# Altium schematic sheet MCU.SchDoc
size A3; SheetNumber: 1; SheetTotal: 2
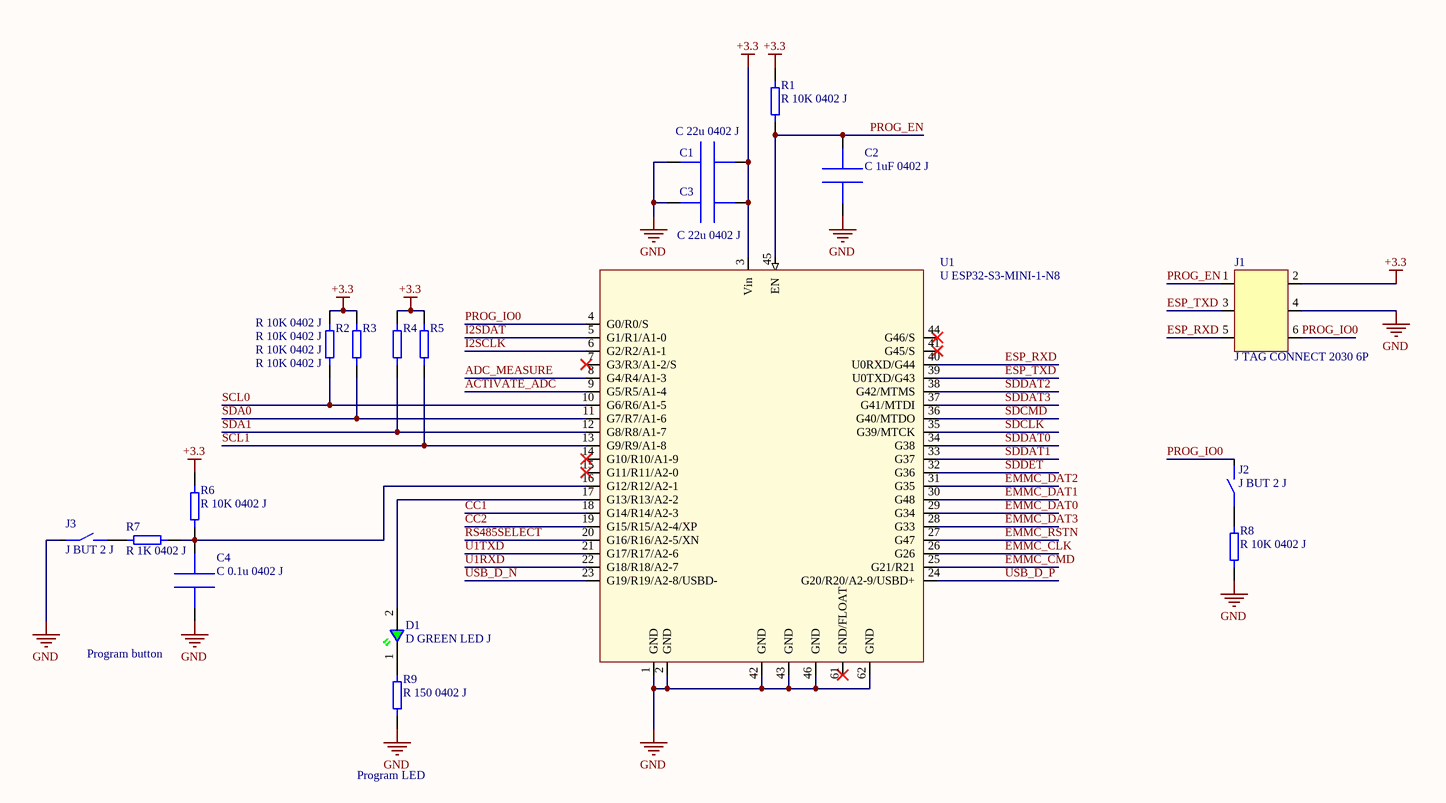
[diagram p0: MCU.SchDoc]

## Parts
C1  C 22u 0402 J  [C0402]
C2  C 1uF 0402 J  [C0402]
C3  C 22u 0402 J  [C0402]
C4  C 0.1u 0402 J  [C0402]
D1  D GREEN LED J  [NCD0402C1]
J1  J TAG CONNECT 2030 6P  [TAG-CONNECT-6]  (no BOM)
J2  J BUT 2 J  [ALPSALPINE BUTTON]
J3  J BUT 2 J  [ALPSALPINE BUTTON]
R1  R 10K 0402 J  [R0402]
R2  R 10K 0402 J  [R0402]
R3  R 10K 0402 J  [R0402]
R4  R 10K 0402 J  [R0402]
R5  R 10K 0402 J  [R0402]
R6  R 10K 0402 J  [R0402]
R7  R 1K 0402 J  [R0402]
R8  R 10K 0402 J  [R0402]
R9  R 150 0402 J  [R0402]
U1  U ESP32-S3-MINI-1-N8  [ESP-S3-MINI]

## Nets
+3.3: C1.1 C3.1 J1.2 R1.2 R2.2 R3.2 R4.2 R5.2 R6.2 U1.3(Vin)
GND: C1.2 C2.1 C3.2 C4.1 J1.4 J3.1 R8.1 R9.1 U1.1(GND) U1.2(GND) U1.42(GND) U1.43(GND) U1.46(GND) U1.62(GND)
ACTIVATE_ADC: U1.9(G5/R5/A1-4)
ADC_MEASURE: U1.8(G4/R4/A1-3)
CC1: U1.18(G14/R14/A2-3)
CC2: U1.19(G15/R15/A2-4/XP)
EMMC_CLK: U1.26(G26)
EMMC_CMD: U1.25(G21/R21)
EMMC_DAT0: U1.29(G34)
EMMC_DAT1: U1.30(G48)
EMMC_DAT2: U1.31(G35)
EMMC_DAT3: U1.28(G33)
EMMC_RSTN: U1.27(G47)
ESP_RXD: J1.5 U1.40(U0RXD/G44)
ESP_TXD: J1.3 U1.39(U0TXD/G43)
I2SCLK: U1.6(G2/R2/A1-1)
I2SDAT: U1.5(G1/R1/A1-0)
PROG_EN: C2.2 J1.1 R1.1 U1.45(EN)
PROG_IO0: J1.6 J2.2 U1.4(G0/R0/S)
RS485SELECT: U1.20(G16/R16/A2-5/XN)
SCL0: R2.1 U1.10(G6/R6/A1-5)
SCL1: R5.1 U1.13(G9/R9/A1-8)
SDA~{0}: R3.1 U1.11(G7/R7/A1-6)
SDA1: R4.1 U1.12(G8/R8/A1-7)
SDCLK: U1.35(G39/MTCK)
SDCMD: U1.36(G40/MTDO)
SDDAT0: U1.34(G38)
SDDAT1: U1.33(G37)
SDDAT2: U1.38(G42/MTMS)
SDDAT3: U1.37(G41/MTDI)
SDDET: U1.32(G36)
U1RXD: U1.22(G18/R18/A2-7)
U1TXD: U1.21(G17/R17/A2-6)
USB_D_N: U1.23(G19/R19/A2-8/USBD-)
USB_D_P: U1.24(G20/R20/A2-9/USBD+)
NetC4_2: C4.2 R6.1 R7.2 U1.16(G12/R12/A2-1)
NetD1_1: D1.1 R9.2
NetD1_2: D1.2 U1.17(G13/R13/A2-2)
NetJ2_1: J2.1 R8.2
NetJ3_2: J3.2 R7.1

Not connected (* = marked no-connect by the designer): U1 7(G3/R3/A1-2/S)* 14(G10/R10/A1-9)* 15(G11/R11/A2-0)* 41(G45/S)* 44(G46/S)* 61(GND/FLOAT)*

## Notes on the sheet
- (near C4) Program button
- Program LED

## Library data of the parts
C1 C3 = C 22u 0402 J: Multi-Layer Ceramic Capacitor 22uF 2.5VDC X6S 20% 0402 Paper T/R GRM155C80E226ME11D; Manufacturer: Murata; Supplier 1: Mouser; Manufacturer Part Number: GRM155C80E226ME11D; RoHS: Yes; Category: Ceramic Capacitors; Stock 1: 30000; Pricing 1: 1=0,32000, 10=0,22300, 50=0,22300, 100=0,13400, 1000=0,08500, 10000=0,06900 (USD); Supplier Part Number 1: 81-GRM155C80E226ME1D; JLCPCB: C907955
C2 = C 1uF 0402 J: Ceramic capacitor SMD 0402 - 1000nF, 10V, +-10%, X5R CL05A105KP5NNNC; Manufacturer: Samsung; Tolerance: 10%; Supplier 1: Arrow Electronics; Manufacturer Part Number: CL05A105KP5NNNC; RoHS: Yes; Category: Ceramic Capacitors; Stock 1: 131; Pricing 1: 1=0,06300, 10=0,04210, 25=0,03040, 100=0,01620, 500=0,01020 (USD); Mount: Surface Mount; Case/Package: 0402; Case Code (Metric): 1005; Case Code (Imperial): 0402; Contact Plating: Tin; Material: Ceramic; Min Operating Temperature: -55°C; Max Operating Temperature: 85°C; Capacitance: 1uF; Package Quantity: 1; Packaging: Tape and Reel; Voltage Rating: 10V; Dielectric: X5R; Series: CL; Length: 1mm; Width: 0.02inch; Height: 0.5mm; Thickness: 0.022inch; Depth: 0.5mm; Radiation Hardening: No; RoHS Compliant: Yes; ComponentLink1URL: http://www.farnell.com/datasheets/2710650.pdf?src-supplier=Farnell; ComponentLink1Description: http://www.farnell.com/datasheets/2710650.pdf?src-supplier=Farnell; ComponentLink2URL: http://www.samsungsem.com/kr/support/product-search/mlcc/CL05A105KP5NNNC.jsp?src-supplier=Digi-Key; ComponentLink2Description: http://www.samsungsem.com/kr/support/product-search/mlcc/CL05A105KP5NNNC.jsp?src-supplier=Digi-Key; ComponentLink3URL: http://www.farnell.com/datasheets/2710650.pdf?src-supplier=Element14; ComponentLink3Description: http://www.farnell.com/datasheets/2710650.pdf?src-supplier=Element14; Supplier 2: Digi-Key; Stock 2: 6411089; Pricing 2: 1=0,10000, 10=0,03600, 50=0,01960, 100=0,01610, 500=0,01148, 1000=0,00903, 2500=0,00821, 5000=0,00755 (USD); Supplier 3: Mouser; Stock 3: 1468368; Pricing 3: 1=0,10000, 10=0,02200, 50=0,02200, 100=0,01700, 500=0,01300, 1000=0,01000, 2500=0,00900, 10000=0,00600, 50000=0,00500 (USD); Supplier Part Number 1: CL05A105KP5NNNC; Supplier Part Number 2: 1276-1076-1-ND; Supplier Part Number 3: 187-CL05A105KP5NNNC; JLCPCB: C14445
C4 = C 0.1u 0402 J: Cap Ceramic 0.1uF 50V X7R 10% Pad SMD 0402 125C Low ESR Automotive CL05B104KB54PNC; Manufacturer: Samsung; Supplier 1: Digi-Key; Manufacturer Part Number: CL05B104KB54PNC; RoHS: Yes; Category: Ceramic Capacitors; Stock 1: 3863336; Pricing 1: 1=0,10000, 10=0,04600, 50=0,02500, 100=0,02040, 500=0,01460, 1000=0,01147, 2500=0,01043, 5000=0,00959 (USD); RoHS Compliant: Yes; Supplier Part Number 1: 1276-CL05B104KB54PNCCT-ND; JLCPCB: C307331
D1 = D GREEN LED J: Green/Yellow-Green 0402 Light Emitting Diodes (LED) ROHS NCD0402C1; Manufacturer: Foshan NationStar Optoelectronics; Manufacturer Part Number: NCD0402C1; JLCPCB: C130722
J1 = J TAG CONNECT 2030 6P: Direct programming with TAG CONNECT 2030
J2 J3 = J BUT 2 J: Switch Tactile N.O. SPST Round Button Gull Wing 0.05A 12VDC 1.57N SMD T/R SKRKAEE020; Manufacturer: Alps Electric; Supplier 1: Newark; Manufacturer Part Number: SKRKAEE020; RoHS: Yes; Category: Tactile Switches; Stock 1: 31500; Pricing 1: 4500=0,13500 (USD); RoHS Compliant: Yes; Supplier 2: Mouser; Stock 2: 43207; Pricing 2: 1=0,76000, 10=0,67100, 50=0,60600, 100=0,51800, 1000=0,43900, 10000=0,37600 (USD); Supplier 3: RSComponents; JLCPCB: C115357; Supplier Part Number 3: 194714; Supplier Part Number 2: 688-SKRKAEE020; Supplier Part Number 1: 79AH6587
R1-R6 R8 = R 10K 0402 J: Res Thick Film 0402 10K Ohm 1% 0.063W(1/16W) ±100ppm/C Pad SMD Automotive T/R AC0402FR-0710KL; Manufacturer: Yageo; Resistance: 10kR; Power Rating: 62.5mW; Voltage Rating: 50V; Temperature Coefficient: 100ppm/°C; Max Power Dissipation: 63mW; Supplier 1: Arrow Electronics; Manufacturer Part Number: AC0402FR-0710KL; RoHS: Yes; Category: Chip SMD Resistors; Stock 1: 46; Pricing 1: 1=0,08140, 10=0,02850, 25=0,02750 (USD); Case/Package: 0402; Case Code (Imperial): 0402; Case Code (Metric): 1005; Size Code: 0402; Min Operating Temperature: -55°C; Max Operating Temperature: 155°C; Tolerance: 1%; Packaging: Tape and Reel; Resistor Type: Thick Film; Termination: SMD/SMT; Number of Terminations: 2; Features: Moisture Resistant,Automotive AEC-Q200; Series: AC; Construction: Rectangular; Length: 0.039inch; Width: 0.02inch; Height: 0.015inch; Depth: 0.5mm; Military Standard: Not; Lead Free: Lead Free; RoHS Compliant: Yes; ComponentLink1URL: https://datasheet.ciiva.com/12656/pyu-ac-51-rohs-l-2-12656634.pdf?src-supplier=Mouser; ComponentLink1Description: https://datasheet.ciiva.com/12656/pyu-ac-51-rohs-l-2-12656634.pdf?src-supplier=Mouser; Supplier 2: RSComponents; Stock 2: 17000; Pricing 2: 10000=0,00200 (GBP); Supplier 3: Digi-Key; Stock 3: 1574588; Pricing 3: 1=0,10000, 10=0,02000, 100=0,00830, 1000=0,00371, 2500=0,00322, 5000=0,00266 (USD); Supplier 4: Mouser; Stock 4: 3990115; Pricing 4: 1=0,10000, 10=0,01500, 50=0,01500, 100=0,00700, 1000=0,00300, 5000=0,00200, 10000=0,00200 (USD); Supplier Part Number 1: AC0402FR-0710KL; Supplier Part Number 2: 1977965; Supplier Part Number 3: YAG3436CT-ND; Supplier Part Number 4: 603-AC0402FR-0710KL; JLCPCB: C144807
R7 = R 1K 0402 J: Res Thick Film 0402 1K Ohm 1% 0.063W(1/16W) ±100ppm/C Pad SMD Automotive T/R; Manufacturer: Yageo; Manufacturer Part Number: AC0402FR-071KL; Resistance: 1kR; Power Rating: 62.5mW; Voltage Rating: 50V; Max Power Dissipation: 63mW; Temperature Coefficient: 100ppm/°C; Supplier 1: Arrow Electronics; RoHS: Yes; Category: Chip SMD Resistors; Stock 1: 269; Pricing 1: 1=0,05050, 10=0,03670, 25=0,01910, 100=0,00800, 250=0,00790 (USD); Case/Package: 0402; Case Code (Metric): 1005; Case Code (Imperial): 0402; Size Code: 0402; Min Operating Temperature: -55°C; Max Operating Temperature: 155°C; Package Quantity: 1; Tolerance: 1%; Packaging: Tape and Reel; Resistor Type: Thick Film; Number of Terminations: 2; Termination: SMD/SMT; Features: Moisture Resistant,Automotive AEC-Q200,Anti-Sulfur; Series: AC; Construction: Rectangular; Length: 0.039inch; Width: 0.02inch; Height: 0.015inch; Depth: 0.5mm; Military Standard: Not; Lead Free: Lead Free; RoHS Compliant: Yes; ComponentLink1URL: http://www.mouser.com/ds/2/447/yageodocoutput-1111992.pdf?src-supplier=Mouser; ComponentLink1Description: http://www.mouser.com/ds/2/447/yageodocoutput-1111992.pdf?src-supplier=Mouser; ComponentLink2URL: http://www.yageo.com/NewPortal/yageodocoutput?fileName=/pdf/R-Chip/PYu-AC_51_RoHS_L_6.pdf&src-supplier=Digi-Key; ComponentLink2Description: http://www.yageo.com/NewPortal/yageodocoutput?fileName=/pdf/R-Chip/PYu-AC_51_RoHS_L_6.pdf&src-supplier=Digi-Key; ComponentLink3URL: http://www.yageo.com/documents/recent/PYu-AC_51_RoHS_L_2_revised.pdf?src-supplier=Future+Electronics; ComponentLink3Description: http://www.yageo.com/documents/recent/PYu-AC_51_RoHS_L_2_revised.pdf?src-supplier=Future+Electronics; Supplier 2: RSComponents; Stock 2: 109000; Pricing 2: 5000=0,00300 (GBP); Supplier 3: Digi-Key; Stock 3: 1440182; Pricing 3: 1=0,10000, 10=0,02000, 100=0,00830, 1000=0,00371, 2500=0,00322, 5000=0,00266 (USD); Supplier 4: Mouser; Stock 4: 1563596; Pricing 4: 1=0,10000, 10=0,01500, 50=0,01500, 100=0,00700, 1000=0,00300, 10000=0,00200 (USD); Supplier Part Number 1: AC0402FR-071KL; Supplier Part Number 2: 1977971P; Supplier Part Number 3: 311-1KLBCT-ND; Supplier Part Number 4: 603-AC0402FR-071KL; JLCPCB: C144789
R9 = R 150 0402 J: Res General Purpose Thick Film 0402 150 Ohm 1% 1/16W ±100ppm/°C Molded SMD Paper T/R RC0402FR-07150RL; Manufacturer: Yageo; Resistance: 150R; Power Rating: 62.5mW; Voltage Rating: 50V; Max Power Dissipation: 63mW; Supplier 1: Arrow Electronics; Manufacturer Part Number: RC0402FR-07150RL; RoHS: Yes; Category: Chip SMD Resistors; Stock 1: 70000; Pricing 1: 10000=0,00140 (USD); Case/Package: 0402; Case Code (Metric): 1005; Case Code (Imperial): 0402; Min Operating Temperature: -55°C; Max Operating Temperature: 155°C; Tolerance: 1%; Packaging: Tape and Reel; Package Quantity: 1; Resistor Type: Thick Film; Number of Terminations: 2; Termination: SMD/SMT; Temperature Coefficient: 100ppm/°C; Working Voltage: 50V; Features: Moisture Resistant; Series: RC; Resistance Tolerance: 1%; Construction: Rectangular; Technology: THICK FILM; Length: 1mm; Width: 0.02inch; Height: 0.016inch; Depth: 0.5mm; REACH SVHC: No SVHC; Military Standard: Not; Lead Free: Lead Free; RoHS Compliant: Yes; ComponentLink1URL: https://datasheet.ciiva.com/11808/0900766b80c66297-11808422.pdf?src-supplier=RSComponents; ComponentLink1Description: https://datasheet.ciiva.com/11808/0900766b80c66297-11808422.pdf?src-supplier=RSComponents; ComponentLink2URL: https://datasheet.ciiva.com/7983/1018594-7983495.pdf?src-supplier=Element14; ComponentLink2Description: https://datasheet.ciiva.com/7983/1018594-7983495.pdf?src-supplier=Element14; ComponentLink3URL: https://datasheet.ciiva.com/2453/pyu-r-int-thick-7-2453374.pdf?src-supplier=Digi-Key; ComponentLink3Description: https://datasheet.ciiva.com/2453/pyu-r-int-thick-7-2453374.pdf?src-supplier=Digi-Key; ComponentLink4URL: https://datasheet.ciiva.com/2453/pyu-r-int-thick-7-2453375.pdf?src-supplier=Digi-Key; ComponentLink4Description: https://datasheet.ciiva.com/2453/pyu-r-int-thick-7-2453375.pdf?src-supplier=Digi-Key; ComponentLink5URL: https://datasheet.ciiva.com/2453/pyu-r-int-thick-7-2453373.pdf?src-supplier=Digi-Key; ComponentLink5Description: https://datasheet.ciiva.com/2453/pyu-r-int-thick-7-2453373.pdf?src-supplier=Digi-Key; ComponentLink6URL: https://datasheet.ciiva.com/5558/pyu-rc0402-51-rohs-l-6-r-5558110.pdf?src-supplier=Mouser; ComponentLink6Description: https://datasheet.ciiva.com/5558/pyu-rc0402-51-rohs-l-6-r-5558110.pdf?src-supplier=Mouser; ComponentLink7URL: https://datasheet.ciiva.com/7849/1018594-7849838.pdf?src-supplier=Element14; ComponentLink7Description: https://datasheet.ciiva.com/7849/1018594-7849838.pdf?src-supplier=Element14; ComponentLink8URL: https://datasheet.ciiva.com/7849/1018594-7849839.pdf?src-supplier=Element14; ComponentLink8Description: https://datasheet.ciiva.com/7849/1018594-7849839.pdf?src-supplier=Element14; ComponentLink9URL: https://datasheet.ciiva.com/16740/pyu-rc0402-51-rohs-l-6-r-16740923.pdf?src-supplier=Future+Electronics; ComponentLink9Description: https://datasheet.ciiva.com/16740/pyu-rc0402-51-rohs-l-6-r-16740923.pdf?src-supplier=Future+Electronics; ComponentLink10URL: https://datasheet.ciiva.com/15189/getdatasheetpartid-330680-15189357.pdf?src-supplier=Verical; ComponentLink10Description: https://datasheet.ciiva.com/15189/getdatasheetpartid-330680-15189357.pdf?src-supplier=Verical; Supplier 2: RSComponents; Stock 2: 10800; Pricing 2: 10000=0,00200, 50000=0,00200, 100000=0,00200, 200000=0,00200, 400000=0,00200 (GBP); Supplier 3: Digi-Key; Stock 3: 2629290; Pricing 3: 1=0,10000, 10=0,01500, 100=0,00610, 1000=0,00275, 2500=0,00239, 5000=0,00197 (USD); JLCPCB: C138054; Supplier Part Number 1: RC0402FR-07150RL; Supplier Part Number 2: 1987666; Supplier Part Number 3: 311-150LRCT-ND
U1 = U ESP32-S3-MINI-1-N8: SMD Module, ESP32-S3FN8, 8 mb Sp ESP32-S3-MINI-1-N8; Manufacturer: Espressif Systems; Supplier 1: Digi-Key; Manufacturer Part Number: ESP32-S3-MINI-1-N8; RoHS: No; Category: Uncategorized; Stock 1: 6782; Pricing 1: 1=3,41000 (USD); JLCPCB: C2913206; Supplier Part Number 1: 1965-ESP32-S3-MINI-1-N8-ND; ComponentLink1Description: Real datasheet; ComponentLink1URL: https://www.espressif.com/sites/default/files/documentation/esp32-s3-mini-1_mini-1u_datasheet_en.pdf